# EasyEDA schematic SCH - RC2014- Dev V1.1 - freeroute.json

## Sheets
1 SCH - RC2014 - Dev V1.1: TITLE: ZX EPM7128 PROTOTYPE - CPLD; REV: V1.1; Date: 17-08-2022; Sheet: 1/2
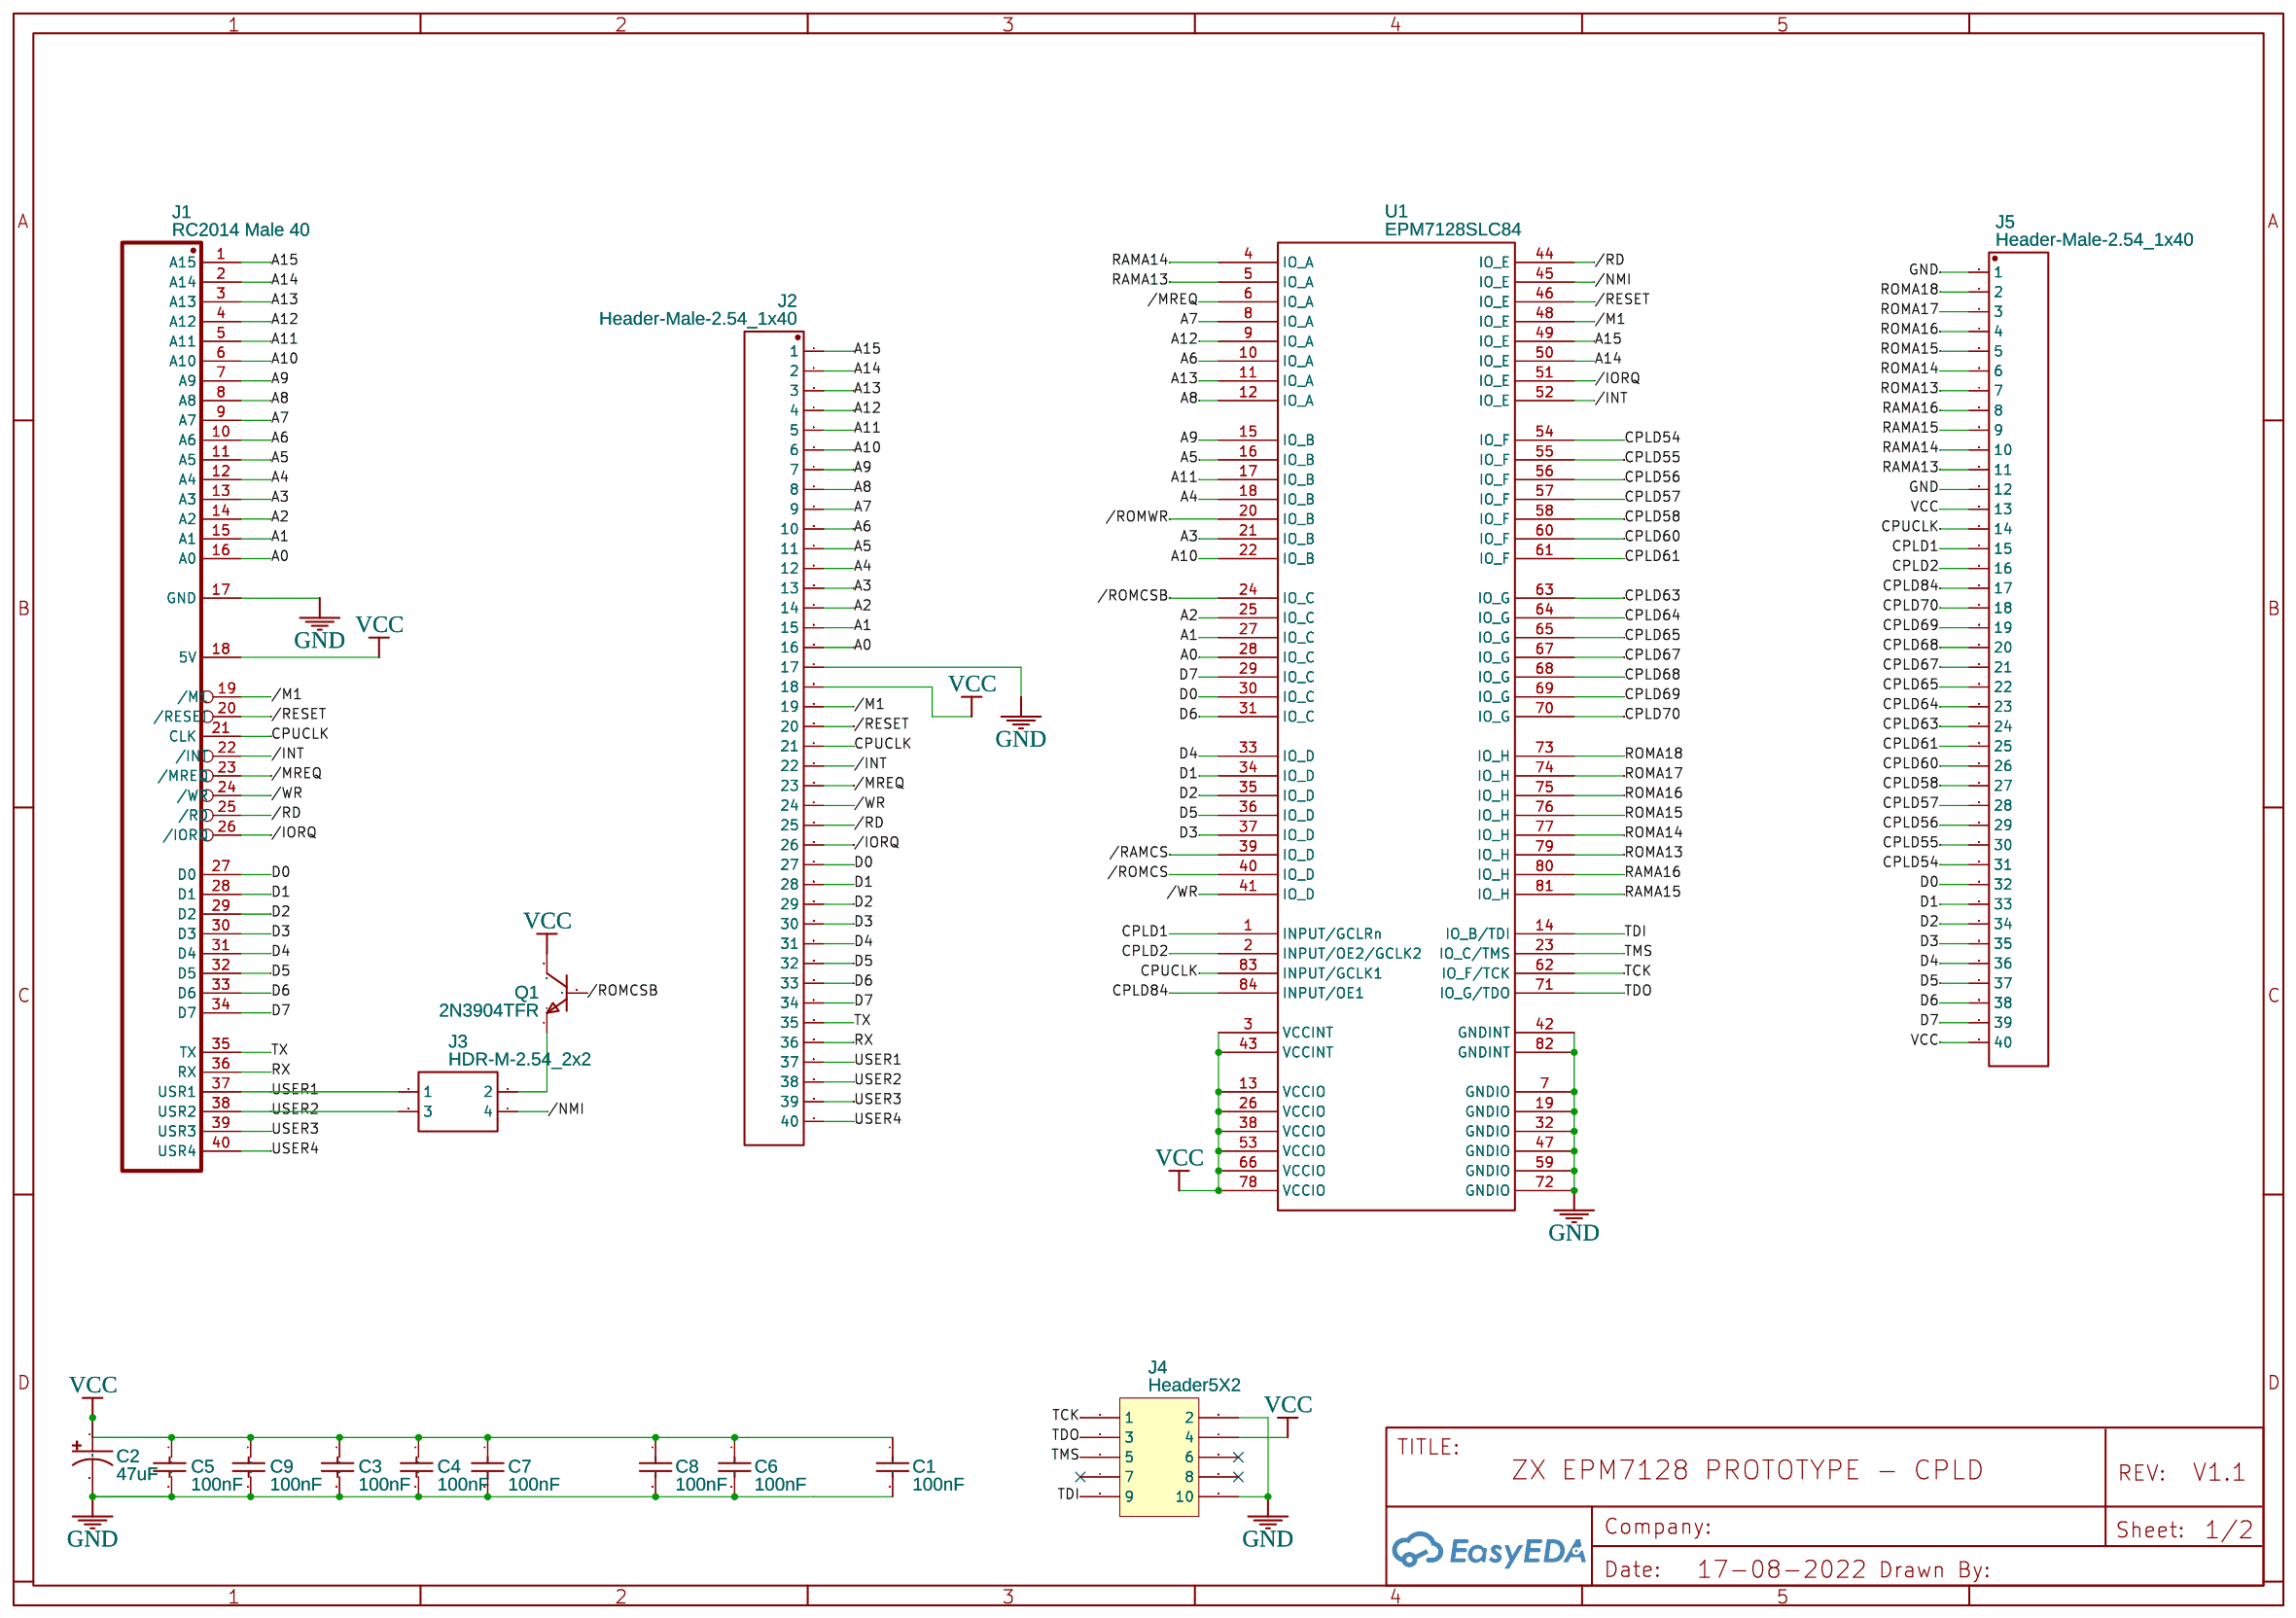
[diagram p0: SCH - RC2014 - Dev V1.1]
2 SCH - ROM & RAM: TITLE: ZX EPM7128 PROTOTYPE - ROM & RAM; Sheet: 2/2
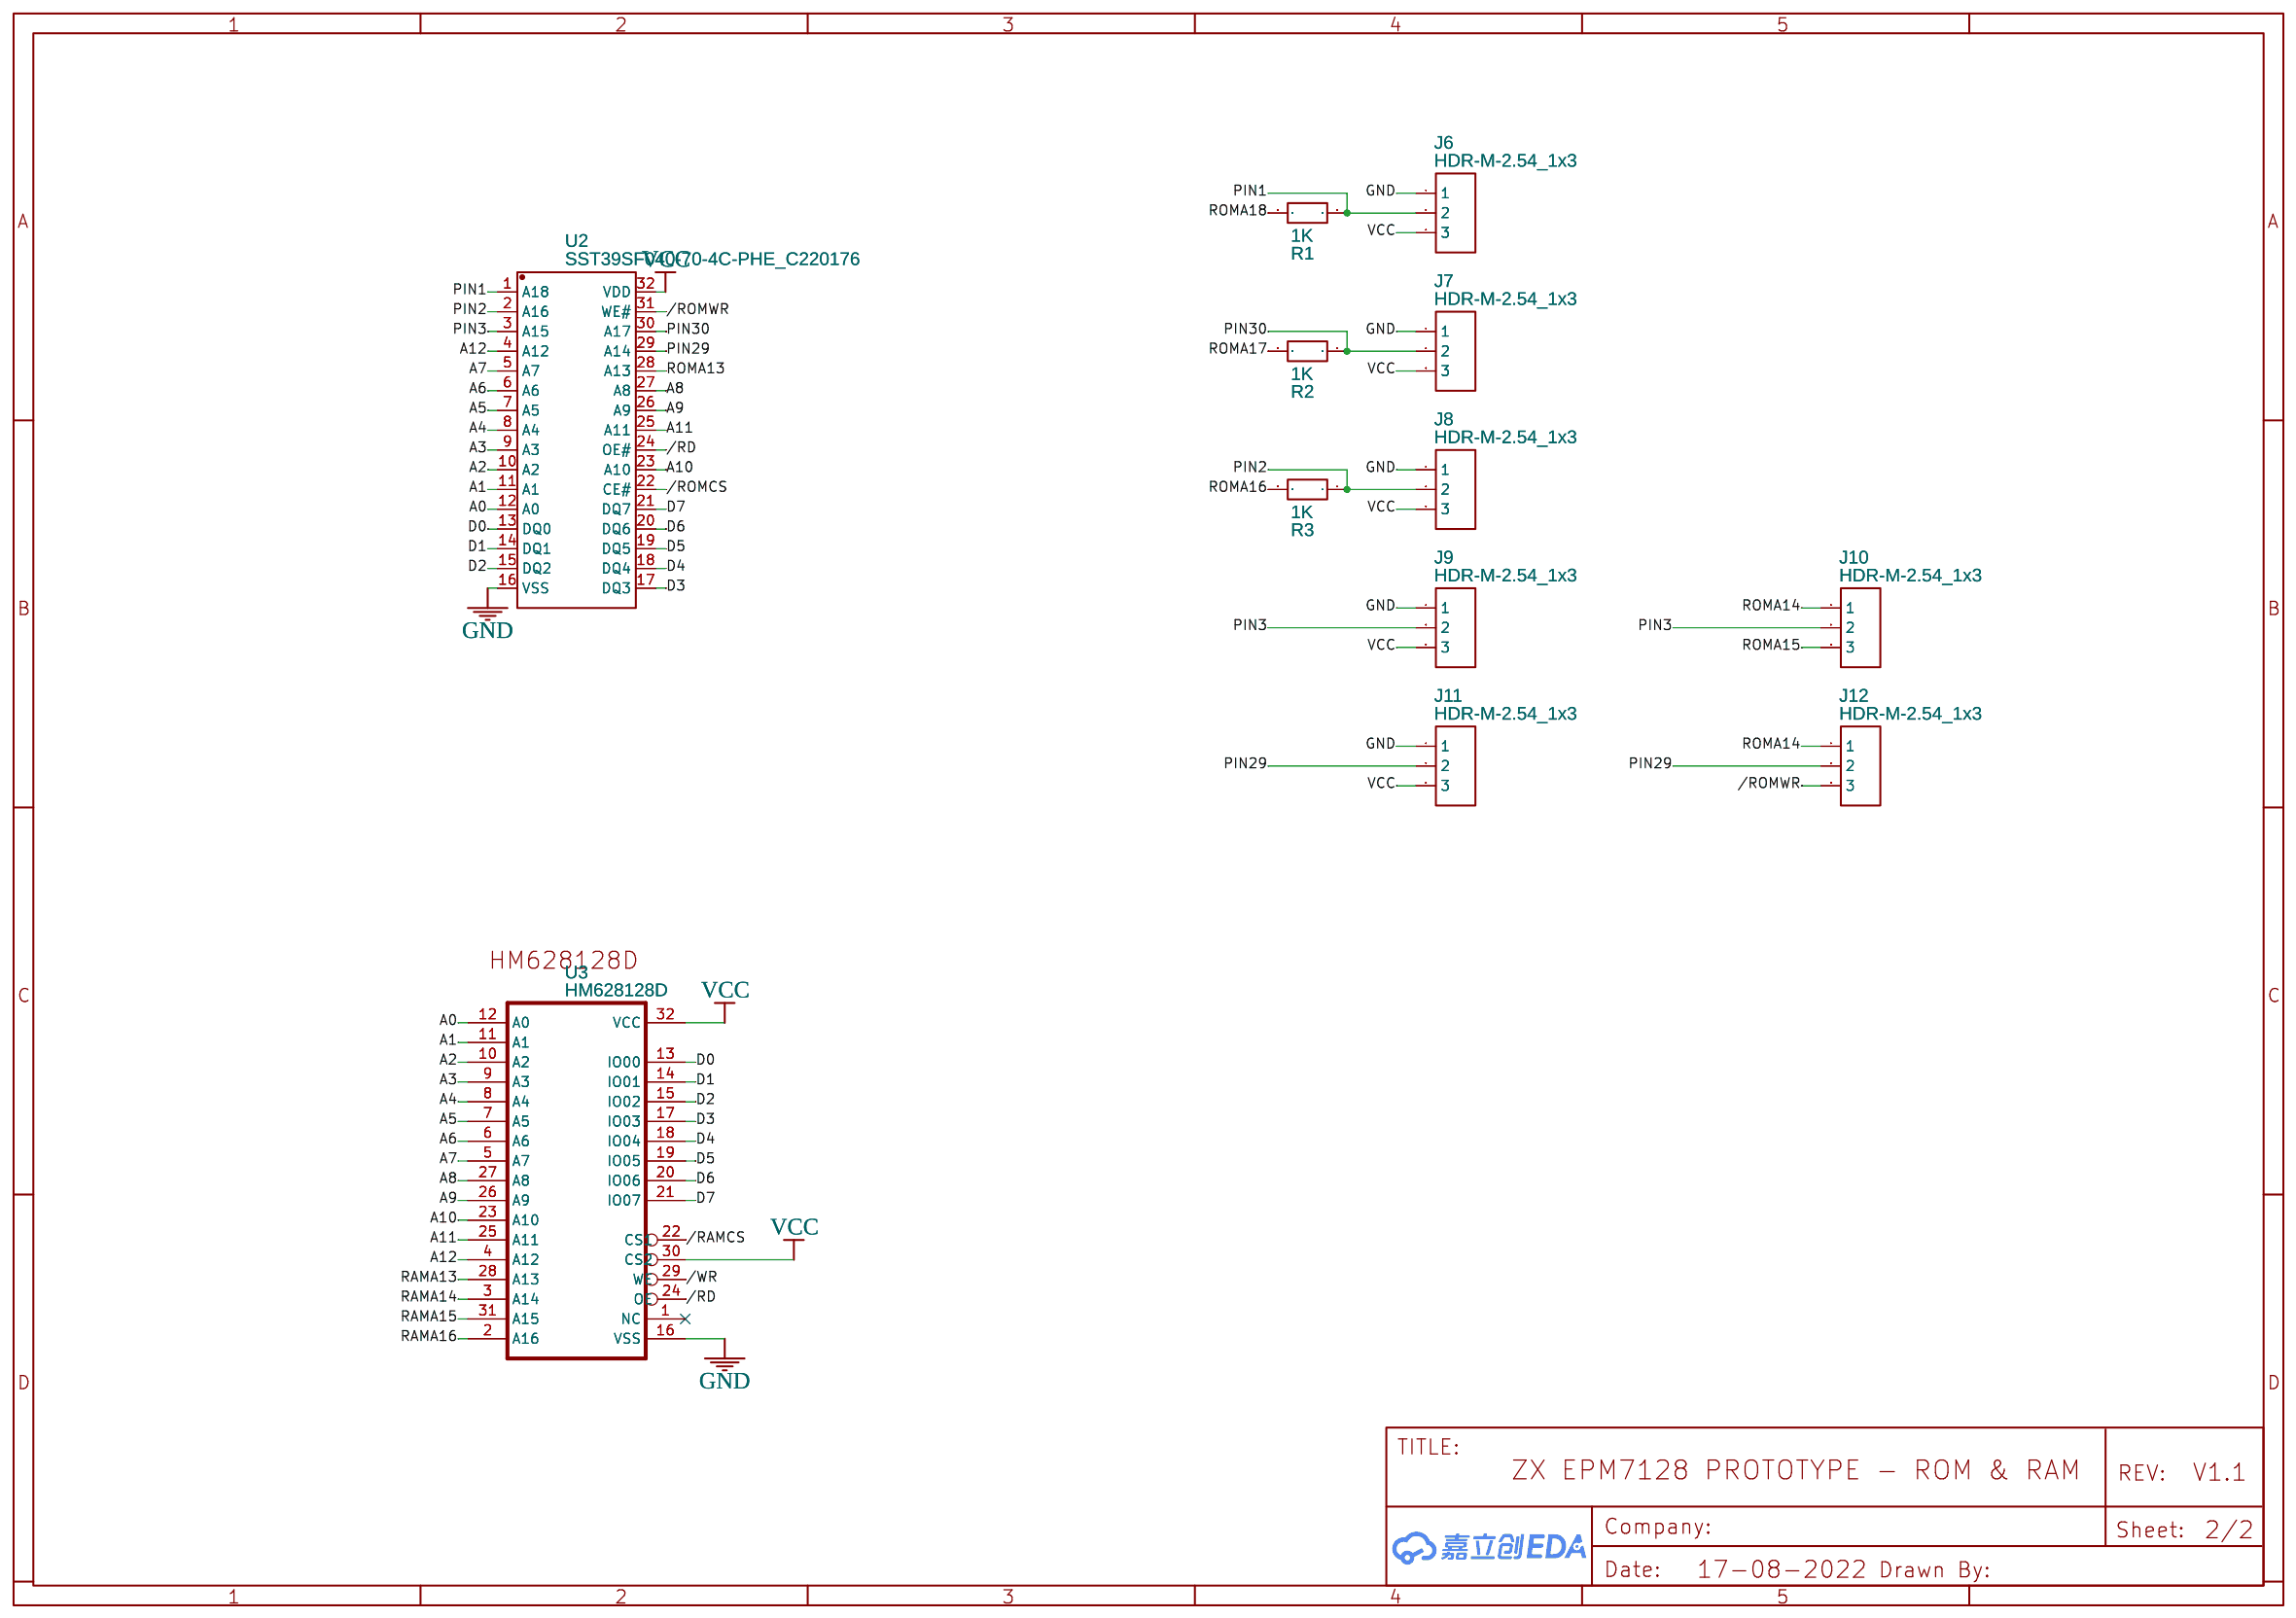
[diagram p1: SCH - ROM & RAM]

## Parts
sheet SCH - RC2014 - Dev V1.1
C1  100nF  [CAP-TH_L5.5-W3.5-P2.50-D0.5 COPY]
C2  47uF  [CAP-TH_BD6.3-P2.50-D1.0-FD]
C3  100nF  [CAP-TH_L5.5-W3.5-P2.50-D0.5 COPY]
C4  100nF  [CAP-TH_L5.5-W3.5-P2.50-D0.5 COPY]
C5  100nF  [CAP-TH_L5.5-W3.5-P2.50-D0.5 COPY]
C6  100nF  [CAP-TH_L5.5-W3.5-P2.50-D0.5 COPY]
C7  100nF  [CAP-TH_L5.5-W3.5-P2.50-D0.5 COPY]
C8  100nF  [CAP-TH_L5.5-W3.5-P2.50-D0.5 COPY]
C9  100nF  [CAP-TH_L5.5-W3.5-P2.50-D0.5 COPY]
J1  RC2014 Male 40  [HDR-1X40-A-M-R-2.54MM]
J2  Header-Male-2.54_1x40  [HDR-TH_40P-P2.54-V-M-1]
J3  HDR-M-2.54_2x2  [HDR-M-2.54_2X2]
J4  Header5X2  [HDR-M-2.54_2X5]
J5  Header-Male-2.54_1x40  [HDR-TH_40P-P2.54-V-M-1]
Q1  2N3904TFR  [TO-92-3_L4.8-W3.7-P2.54-L]
U1  EPM7128SLC84  [PLCC84_PTH-SKT]
sheet SCH - ROM & RAM
J6  HDR-M-2.54_1x3  [HDR-M-2.54_1X3]
J7  HDR-M-2.54_1x3  [HDR-M-2.54_1X3]
J8  HDR-M-2.54_1x3  [HDR-M-2.54_1X3]
J9  HDR-M-2.54_1x3  [HDR-M-2.54_1X3]
J10  HDR-M-2.54_1x3  [HDR-M-2.54_1X3]
J11  HDR-M-2.54_1x3  [HDR-M-2.54_1X3]
J12  HDR-M-2.54_1x3  [HDR-M-2.54_1X3]
R1  1K  [R_AXIAL-0.3 COPY]
R2  1K  [R_AXIAL-0.3 COPY]
R3  1K  [R_AXIAL-0.3 COPY]
U2  SST39SF040-70-4C-PHE_C220176  [PDIP-32_L42.0-W13.7-P2.54-LS15.2-BL]
U3  HM628128D  [HM628128ALP-7 COPY]

## Library data of the parts
C1 C3-C9 = 100nF (104) ±20% 100V: Supplier: LCSC; Manufacturer: ReliaPro; Supplier Part: C72322
C2 = KM1H470ME110A00CV0: Supplier: LCSC; Supplier Part: C190654; Manufacturer: Changzhou Huawei Elec; Contributor: LCSC; JLCPCB Part Class: Extended Part
J1 = RC2014 Male 40
J2 J5 = Header-Male-2.54_1x40: Supplier: LCSC; Manufacturer: BOOMELE; Manufacturer Part: 2.54mm 1x40P; Supplier Part: C2337; JLCPCB Part Class: Extended Part
J3 = HDR-M-2.54_2x2: Supplier Part: C66690; Supplier: LCSC; Contributor: LCEDA_Lib
J4 = Header5X2: Supplier Part: S9169-ND; Supplier: Digi-Key; Manufacturer: Sullins; Manufacturer Part: SBH11-PBPC-D05-ST-BK; Contributor: Min Lan
Q1 = 2N3904TFR: Supplier: LCSC; Supplier Part: C258185; Manufacturer: ON Semicon; Contributor: LCSC; JLCPCB Part Class: Extended Part
U1 = EPM7128SLC84: Supplier Part: 692-Z8S18020VEG; Supplier: Mouser; link: http://www.mouser.com/ds/2/450/z8s180ps-28828.pdf; Contributor: cocus
J6-J12 = HDR-M-2.54_1x3: Supplier Part: C180248; Supplier: LCSC; Contributor: LCEDA_Lib
R1-R3 = R_AXIAL-0.3_EU: Contributor: LCEDA_Lib
U2 = SST39SF040-70-4C-PHE_C220176: Supplier: LCSC; Supplier Part: C220176; Manufacturer: Microchip Tech; Manufacturer Part: SST39SF040-70-4C-PHE; Contributor: LCSC; JLCPCB Part Class: Extended Part
U3 = HM628128D: Contributor: dembdaoc

## Nets
GND: C1.2 C2.2 C3.2 C4.2 C5.2 C6.2 C7.2 C8.2 C9.2 J1.17(GND) J2.17 J4.2 J4.10 J5.1 J5.12 J6.1 J7.1 J8.1 J9.1 J11.1 U1.7(GNDIO) U1.19(GNDIO) U1.32(GNDIO) U1.42(GNDINT) U1.47(GNDIO) U1.59(GNDIO) U1.72(GNDIO) U1.82(GNDINT) U2.16(VSS) U3.16(VSS)
VCC: C1.1 C2.1 C3.1 C4.1 C5.1 C6.1 C7.1 C8.1 C9.1 J1.18(5V) J2.18 J4.4 J5.13 J5.40 J6.3 J7.3 J8.3 J9.3 J11.3 Q1.3(C) U1.3(VCCINT) U1.13(VCCIO) U1.26(VCCIO) U1.38(VCCIO) U1.43(VCCINT) U1.53(VCCIO) U1.66(VCCIO) U1.78(VCCIO) U2.32(VDD) U3.30(CS2) U3.32(VCC)
/INT: J1.22(/INT) J2.22 U1.52(IO E)
/IORQ: J1.26(/IORQ) J2.26 U1.51(IO E)
/M1: J1.19(/M1) J2.19 U1.48(IO E)
/MREQ: J1.23(/MREQ) J2.23 U1.6(IO A)
/NMI: J3.4 U1.45(IO E)
/RAMCS: U1.39(IO D) U3.22(CS1)
/RD: J1.25(/RD) J2.25 U1.44(IO E) U2.24(OE#) U3.24(OE)
/RESET: J1.20(/RESET) J2.20 U1.46(IO E)
/ROMCS: U1.40(IO D) U2.22(CE#)
/ROMCSB: Q1.2(B) U1.24(IO C)
/ROMWR: J12.3 U1.20(IO B) U2.31(WE#)
/WR: J1.24(/WR) J2.24 U1.41(IO D) U3.29(WE)
A0: J1.16(A0) J2.16 U1.28(IO C) U2.12(A0) U3.12(A0)
A1: J1.15(A1) J2.15 U1.27(IO C) U2.11(A1) U3.11(A1)
A2: J1.14(A2) J2.14 U1.25(IO C) U2.10(A2) U3.10(A2)
A3: J1.13(A3) J2.13 U1.21(IO B) U2.9(A3) U3.9(A3)
A4: J1.12(A4) J2.12 U1.18(IO B) U2.8(A4) U3.8(A4)
A5: J1.11(A5) J2.11 U1.16(IO B) U2.7(A5) U3.7(A5)
A6: J1.10(A6) J2.10 U1.10(IO A) U2.6(A6) U3.6(A6)
A7: J1.9(A7) J2.9 U1.8(IO A) U2.5(A7) U3.5(A7)
A8: J1.8(A8) J2.8 U1.12(IO A) U2.27(A8) U3.27(A8)
A9: J1.7(A9) J2.7 U1.15(IO B) U2.26(A9) U3.26(A9)
A10: J1.6(A10) J2.6 U1.22(IO B) U2.23(A10) U3.23(A10)
A11: J1.5(A11) J2.5 U1.17(IO B) U2.25(A11) U3.25(A11)
A12: J1.4(A12) J2.4 U1.9(IO A) U2.4(A12) U3.4(A12)
A13: J1.3(A13) J2.3 U1.11(IO A)
A14: J1.2(A14) J2.2 U1.50(IO E)
A15: J1.1(A15) J2.1 U1.49(IO E)
CPLD1: J5.15 U1.1(INPUT/GCLRn)
CPLD2: J5.16 U1.2(INPUT/OE2/GCLK2)
CPLD54: J5.31 U1.54(IO F)
CPLD55: J5.30 U1.55(IO F)
CPLD56: J5.29 U1.56(IO F)
CPLD57: J5.28 U1.57(IO F)
CPLD58: J5.27 U1.58(IO F)
CPLD60: J5.26 U1.60(IO F)
CPLD61: J5.25 U1.61(IO F)
CPLD63: J5.24 U1.63(IO G)
CPLD64: J5.23 U1.64(IO G)
CPLD65: J5.22 U1.65(IO G)
CPLD67: J5.21 U1.67(IO G)
CPLD68: J5.20 U1.68(IO G)
CPLD69: J5.19 U1.69(IO G)
CPLD70: J5.18 U1.70(IO G)
CPLD84: J5.17 U1.84(INPUT/OE1)
CPUCLK: J1.21(CLK) J2.21 J5.14 U1.83(INPUT/GCLK1)
D0: J1.27(D0) J2.27 J5.32 U1.30(IO C) U2.13(DQ0) U3.13(IO00)
D1: J1.28(D1) J2.28 J5.33 U1.34(IO D) U2.14(DQ1) U3.14(IO01)
D2: J1.29(D2) J2.29 J5.34 U1.35(IO D) U2.15(DQ2) U3.15(IO02)
D3: J1.30(D3) J2.30 J5.35 U1.37(IO D) U2.17(DQ3) U3.17(IO03)
D4: J1.31(D4) J2.31 J5.36 U1.33(IO D) U2.18(DQ4) U3.18(IO04)
D5: J1.32(D5) J2.32 J5.37 U1.36(IO D) U2.19(DQ5) U3.19(IO05)
D6: J1.33(D6) J2.33 J5.38 U1.31(IO C) U2.20(DQ6) U3.20(IO06)
D7: J1.34(D7) J2.34 J5.39 U1.29(IO C) U2.21(DQ7) U3.21(IO07)
PIN1: J6.2 R1.1 U2.1(A18)
PIN2: J8.2 R3.1 U2.2(A16)
PIN3: J9.2 J10.2 U2.3(A15)
PIN29: J11.2 J12.2 U2.29(A14)
PIN30: J7.2 R2.1 U2.30(A17)
RAMA13: J5.11 U1.5(IO A) U3.28(A13)
RAMA14: J5.10 U1.4(IO A) U3.3(A14)
RAMA15: J5.9 U1.81(IO H) U3.31(A15)
RAMA16: J5.8 U1.80(IO H) U3.2(A16)
ROMA13: J5.7 U1.79(IO H) U2.28(A13)
ROMA14: J5.6 J10.1 J12.1 U1.77(IO H)
ROMA15: J5.5 J10.3 U1.76(IO H)
ROMA16: J5.4 R3.2 U1.75(IO H)
ROMA17: J5.3 R2.2 U1.74(IO H)
ROMA18: J5.2 R1.2 U1.73(IO H)
RX: J1.36(RX) J2.36
TCK: J4.1 U1.62(IO F/TCK)
TDI: J4.9 U1.14(IO B/TDI)
TDO: J4.3 U1.71(IO G/TDO)
TMS: J4.5 U1.23(IO C/TMS)
TX: J1.35(TX) J2.35
USER1: J1.37(USR1) J2.37 J3.1
USER2: J1.38(USR2) J2.38 J3.3
USER3: J1.39(USR3) J2.39
USER4: J1.40(USR4) J2.40
Net-(J3-2): J3.2 Q1.1(E)

Not connected (* = marked no-connect by the designer): J4 6* 7* 8*; U3 1(NC)*
